# EAGLE design ISP_LPC900_USB_V3.3 (EAGLE 5.01)
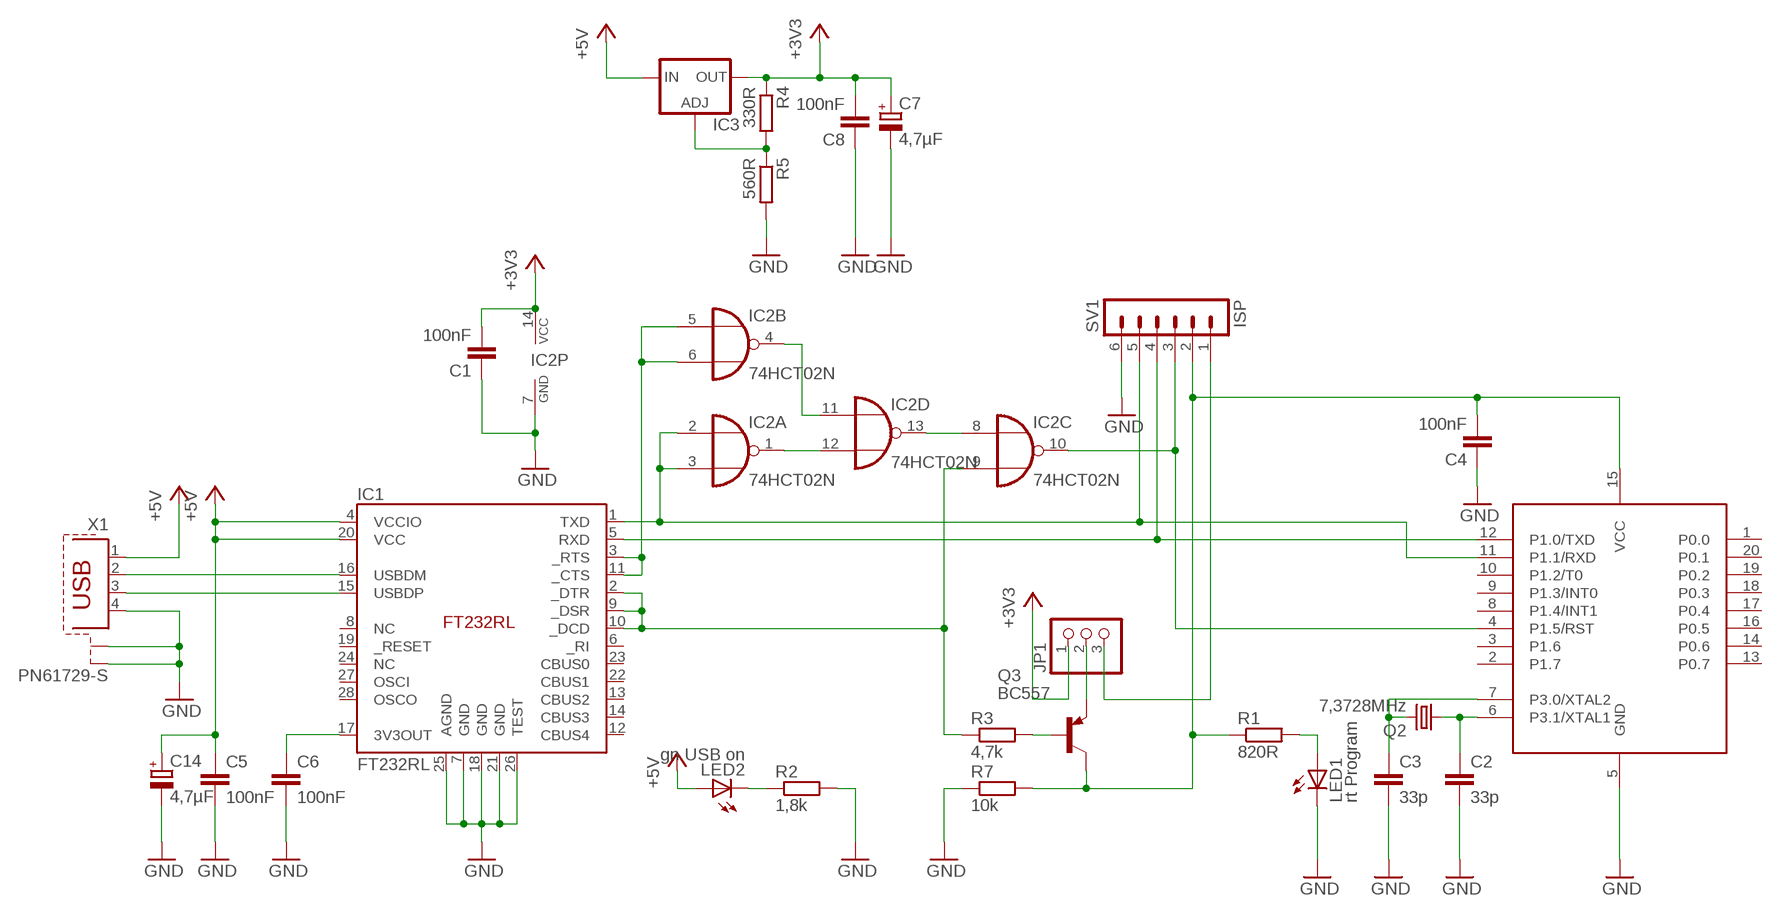
[diagram p0: schematic, sheet 1]

## Parts
C1  100nF  C-EU050-024X044  [C050-024X044]
C2  33p  C-EU025-024X044  [C025-024X044]
C3  33p  C-EU025-024X044  [C025-024X044]
C4  100nF  C-EU050-024X044  [C050-024X044]
C5  100nF  C-EU050-024X044  [C050-024X044]
C6  100nF  C-EU050-024X044  [C050-024X044]
C7  4,7µF  CPOL-EUE2.5-6  [E2,5-6]
C8  100nF  C-EU050-024X044  [C050-024X044]
C14  4,7µF  CPOL-EUE2.5-6  [E2,5-6]
IC1  FT232RL  [SSOP-28]
IC2  74HCT02N  [DIL14]
IC3  LM317L  [317L]
JP1  PINHD-1X3  [1X03]
LED1  rt Program  LED3MM  [LED3MM]
LED2  gn USB on  LED3MM  [LED3MM]
Q2  7,3728MHz  CRYSTALHC49S  [HC49/S]
Q3  BC557  [TO92]
R1  820R  R-EU_0207/7  [0207/7]
R2  1,8k  R-EU_0207/7  [0207/7]
R3  4,7k  R-EU_0204/7  [0204/7]
R4  330R  R-EU_0207/7  [0207/7]
R5  560R  R-EU_0207/7  [0207/7]
R7  10k  R-EU_0207/7  [0207/7]
SV1  ISP  MA06-1  [MA06-1]
U$1  P89LPC922  [DIL20]
X1  PN61729-S  [PN61729-S]

## Nets
+3V3: C1.2 C7.+ C8.2 IC2.14(P:VCC) IC3.2(OUT) JP1.1 R4.1
+5V: C5.1 C14.+ IC1.4(VCCIO) IC1.20(VCC) IC3.3(IN) LED2.A X1.1
DSR_DCD_DTR: IC1.2(_DTR) IC1.9(_DSR) IC1.10(_DCD) IC2.9(C:I1) R3.1
GND: C1.1 C2.2 C3.2 C4.1 C5.2 C6.2 C7.- C8.1 C14.- IC1.7(GND) IC1.18(GND) IC1.21(GND) IC1.25(AGND) IC1.26(TEST) IC2.7(P:GND) LED1.K(C) R2.2 R5.2 R7.1 SV1.6 U$1.5(GND) X1.4 X1.S1 X1.S2
N$1: IC1.5(RXD) SV1.4 U$1.12(P1.0/TXD)
N$2: C3.1 Q2.2 U$1.7(P3.0/XTAL2)
N$3: IC2.4(B:O) IC2.11(D:I0)
N$4: JP1.2 Q3.1(E)
N$5: IC2.10(C:O) SV1.3 U$1.4(P1.5/RST)
N$6: C4.2 Q3.3(C) R1.1 R7.2 SV1.2 U$1.15(VCC)
N$7: JP1.3 SV1.1
N$8: IC1.1(TXD) IC2.2(A:I0) IC2.3(A:I1) SV1.5 U$1.11(P1.1/RXD)
N$9: LED2.K(C) R2.1
N$10: IC2.1(A:O) IC2.12(D:I1)
N$11: C2.1 Q2.1 U$1.6(P3.1/XTAL1)
N$12: C6.1 IC1.17(3V3OUT)
N$13: LED1.A R1.2
N$14: IC1.16(USBDM) X1.2
N$15: IC2.8(C:I0) IC2.13(D:O)
N$16: IC3.1(ADJ) R4.2 R5.1
N$17: IC1.15(USBDP) X1.3
N$19: Q3.2(B) R3.2
RTS_CTS1: IC1.3(_RTS) IC1.11(_CTS) IC2.5(B:I0) IC2.6(B:I1)
Unconnected: IC1.6(_RI) IC1.8(NC) IC1.12(CBUS4) IC1.13(CBUS2) IC1.14(CBUS3) IC1.19(_RESET) IC1.22(CBUS1) IC1.23(CBUS0) IC1.24(NC) IC1.27(OSCI) IC1.28(OSCO) U$1.1(P0.0) U$1.2(P1.7) U$1.3(P1.6) U$1.8(P1.4/INT1) U$1.9(P1.3/INT0) U$1.10(P1.2/T0) U$1.13(P0.7) U$1.14(P0.6) U$1.16(P0.5) U$1.17(P0.4) U$1.18(P0.3) U$1.19(P0.2) U$1.20(P0.1)

## Library data of the parts
C1-C6 C8 = rcl:C-EU: CAPACITOR, European symbol
C7 C14 = rcl:CPOL-EU: POLARIZED CAPACITOR, European symbol
IC1 = ftdi4:FT232RL
IC2 = 74xx-eu:74*02: Quad 2-input NOR gate
IC3 = v-reg:LM317L: VOLTAGE REGULATOR
JP1 = pinhead:PINHD-1X3: PIN HEADER
LED1 LED2 = led:LED: LED OSRAM: - CHIPLED LG R971, LG N971, LY N971, LG Q971, LY Q971, LO R971, LY R971 LH N974, LH R974 LS Q976, LO Q976, LY Q976 LO Q996 - Hyper CHIPLED LW Q18S LB Q993, LB Q99A, LB R99A - SideLED LS A670, LO A670, LY A670, LG A670, LP A670 LB A673, LV A673, LT A673, LW A673 LH A674 LY A675 LS A676, LA A676, LO A676, LY A676, LW A676 LS A679, LY A679, LG A679 - Hyper Micro SIDELED® LS Y876, LA Y876, LO Y876, LY Y876 LT Y87S - SmartLED LW L88C, LW L88S LB L89C, LB L89S, LG L890 LS L89K, LO L89K, LY L89K LS L896, LA L896, LO L896, LY L896 - TOPLED LS T670, LO T670, LY T670, LG T670, LP T670 LSG T670, LSP T670, LSY T670, LOP T670, LYG T670 LG T671, LOG T671, LSG T671 LB T673, LV T673, LT T673, LW T673 LH T674 LS T676, LA T676, LO T676, LY T676, LB T676, LH T676, LSB T676, LW T676 LB T67C, LV T67C, LT T67C, LS T67K, LO T67K, LY T67K, LW E67C LS E67B, LA E67B, LO E67B, LY E67B, LB E67C, LV E67C, LT E67C LW T67C LS T679, LY T679, LG T679 LS T770, LO T770, LY T770, LG T770, LP T770 LB T773, LV T773, LT T773, LW T773 LH T774 LS E675, LA E675, LY E675, LS T675 LS T776, LA T776, LO T776, LY T776, LB T776 LHGB T686 LT T68C, LB T68C - Hyper Mini TOPLED® LB M676 - Mini TOPLED Santana® LG M470 LS M47K, LO M47K, LY M47K Source: http://www.osram.convergy.de - LUMILED® LXK2-PW12-R00, LXK2-PW12-S00, LXK2-PW14-U00, LXK2-PW14-V00 LXK2-PM12-R00, LXK2-PM12-S00, LXK2-PM14-U00 LXK2-PE12-Q00, LXK2-PE12-R00, LXK2-PE12-S00, LXK2-PE14-T00, LXK2-PE14-U00 LXK2-PB12-K00, LXK2-PB12-L00, LXK2-PB12-M00, LXK2-PB14-N00, LXK2-PB14-P00, LXK2-PB14-Q00 LXK2-PR12-L00, LXK2-PR12-M00, LXK2-PR14-Q00, LXK2-PR14-R00 LXK2-PD12-Q00, LXK2-PD12-R00, LXK2-PD12-S00 LXK2-PH12-R00, LXK2-PH12-S00 LXK2-PL12-P00, LXK2-PL12-Q00, LXK2-PL12-R00 Source: www.luxeon.com
Q2 = crystal:CRYSTAL: CRYSTAL
Q3 = transistor-pnp:BC557: PNP Transistor
R1-R5 R7 = rcl:R-EU_: RESISTOR, European symbol
SV1 = con-lstb:MA06-1: PIN HEADER
U$1 = micro-philips:P89LPC922
X1 = con-berg:PN61729-S: BERG USB connector

## Board
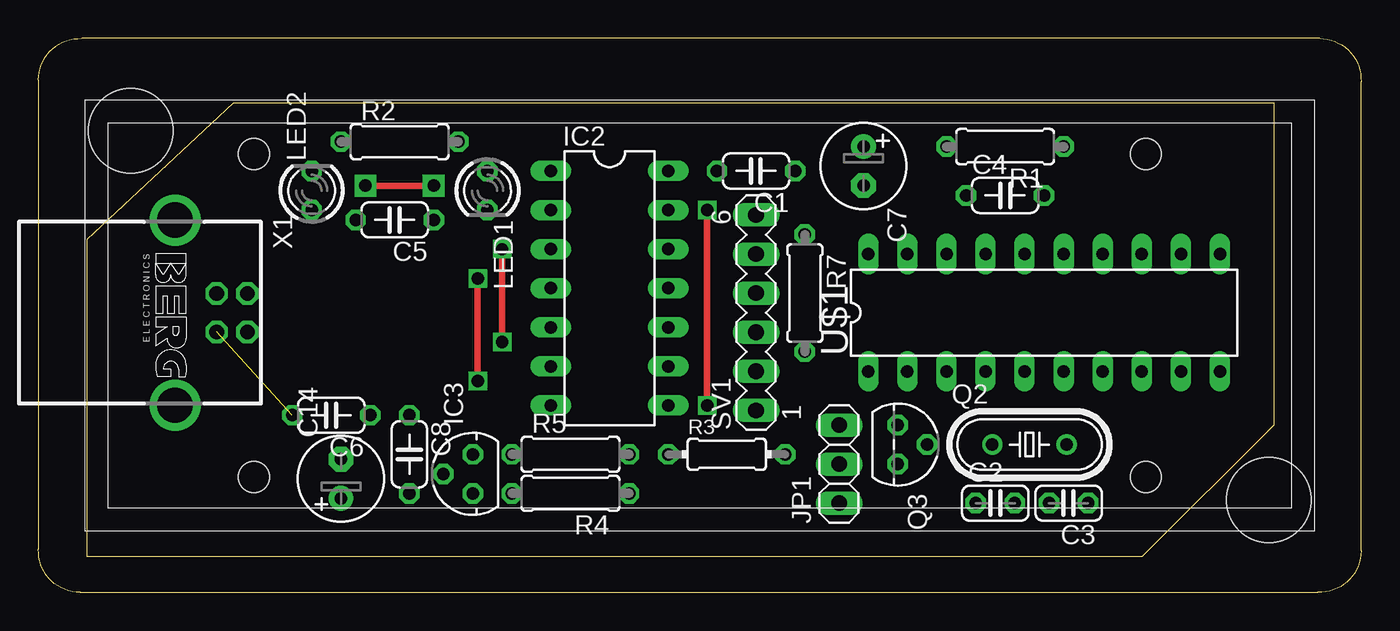
[diagram p1: board, top side]
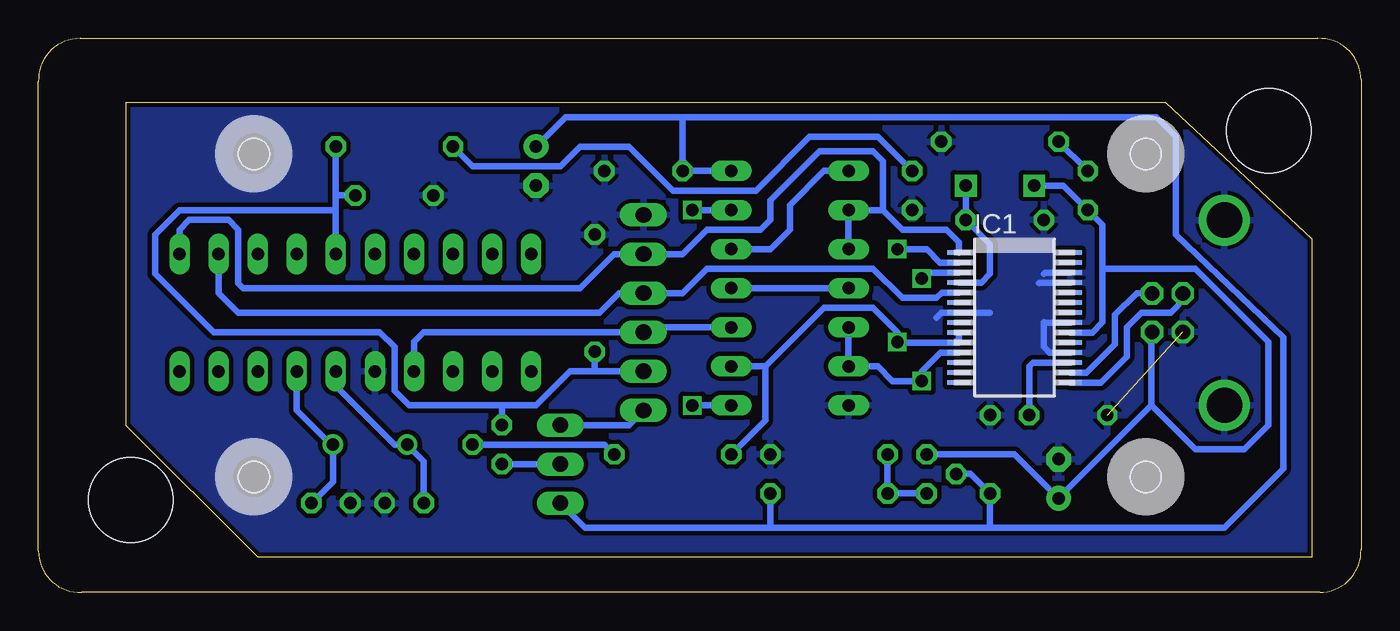
[diagram p2: board, bottom side, seen from below]

Size 86 x 36 mm. Coordinates in mm from the lower left corner, seen from the top.
Outline: 86,2.7 86,33.2 arc92 83.3,36 2.8,36 arc92 0,33.3 0,2.8 arc92 2.7,0 83.2,0 arc92 86,2.7
Outline: 80.31,10.88 71.74,2.3 3.16,2.3 3.16,22.94 12.69,31.83 80.31,31.83 80.31,10.88
Copper layers (1*16): Top 0.035mm / dielectric 1.5mm / Bottom 0.035mm
Design rules "default *": minimum track width 10mil, minimum drill 24mil, track to track 8mil, track to pad 8mil, pad to pad 8mil, via to via 8mil, smd to smd 8mil, copper to edge 10mil, drill to drill 10mil, minimum pad ring 10mil, minimum via ring 8mil, stop-mask expansion 4mil, vias tented up to drill 0mil, thermal gap 10mil
Holes 2 mm at 14,7.5 14,28.5 72,7.5 72,28.5
Holes 5.5 mm at 6,30 80,6

### Footprints (pad centres in the part's own frame; a part is rotated, then mirrored left to right if it is on the bottom)
C050-024X044 = drill 0.813 octagon: 1 -2.54,0; 2 2.54,0
C025-024X044 = drill 0.813 octagon: 1 -1.27,0; 2 1.27,0
E2,5-6 = drill 0.813 pad 1.6 round: + -1.27,0 | drill 0.813 pad 1.6 octagon: - 1.27,0
SSOP-28 = smd 0.3 x 1.5: 1 -4.225,-3.625; 2 -3.575,-3.625; 3 -2.925,-3.625; 4 -2.275,-3.625; 5 -1.625,-3.625; 6 -0.975,-3.625; 7 -0.325,-3.625; 8 0.325,-3.625; 9 0.975,-3.625; 10 1.625,-3.625; 11 2.275,-3.625; 12 2.925,-3.625; 13 3.575,-3.625; 14 4.225,-3.625; 15 4.225,3.625; 16 3.575,3.625; 17 2.925,3.625; 18 2.275,3.625; 19 1.625,3.625; 20 0.975,3.625; 21 0.325,3.625; 22 -0.325,3.625; 23 -0.975,3.625; 24 -1.625,3.625; 25 -2.275,3.625; 26 -2.925,3.625; 27 -3.575,3.625; 28 -4.225,3.625
DIL14 = drill 0.813 long: 1 -7.62,-3.81; 2 -5.08,-3.81; 3 -2.54,-3.81; 4 0,-3.81; 5 2.54,-3.81; 6 5.08,-3.81; 7 7.62,-3.81; 8 7.62,3.81; 9 5.08,3.81; 10 2.54,3.81; 11 0,3.81; 12 -2.54,3.81; 13 -5.08,3.81; 14 -7.62,3.81
317L = drill 0.813 octagon: 1 -1.27,0; 2 0,1.905; 3 1.27,0
1X03 = drill 1.016 long: 1 -2.54,0; 2 0,0; 3 2.54,0
LED3MM = drill 0.813 octagon: A -1.27,0; K 1.27,0
HC49/S = drill 0.813 round: 1 -2.413,0; 2 2.413,0
TO92 = drill 0.813 octagon: 1 1.27,0; 2 0,1.905; 3 -1.27,0
0207/7 = drill 0.813 octagon: 1 -3.81,0; 2 3.81,0
0204/7 = drill 0.813 octagon: 1 -3.81,0; 2 3.81,0
MA06-1 = drill 1.016 long: 1 -6.35,0; 2 -3.81,0; 3 -1.27,0; 4 1.27,0; 5 3.81,0; 6 6.35,0
DIL20 = drill 0.813 long: 1 -11.43,-3.81; 2 -8.89,-3.81; 3 -6.35,-3.81; 4 -3.81,-3.81; 5 -1.27,-3.81; 6 1.27,-3.81; 7 3.81,-3.81; 8 6.35,-3.81; 9 8.89,-3.81; 10 11.43,-3.81; 11 11.43,3.81; 12 8.89,3.81; 13 6.35,3.81; 14 3.81,3.81; 15 1.27,3.81; 16 -1.27,3.81; 17 -3.81,3.81; 18 -6.35,3.81; 19 -8.89,3.81; 20 -11.43,3.81
PN61729-S = drill 0.95 octagon: 1 1.25,4.71; 2 -1.25,4.71; 3 -1.25,2.71; 4 1.25,2.71 | drill 2.3 pad 2.9 round: S1 -6.02,0; S2 6.02,0

### Placement (x,y rotation side)
C1  46.66,27.39 180 top
C2  62.22,5.79 0 top
C3  66.98,5.79 180 top
C4  62.85,25.8 0 top
C5  23.16,24.21 180 top
C6  19.04,11.51 180 top
C7  53.64,27.7 270 top
C8  24.12,8.97 270 top
C14  19.67,7.38 90 top
IC1  22.53,17.86 270 bottom
IC2  37.13,19.77 270 top
IC3  28.24,7.7 90 top
JP1  52.06,8.34 90 top
LED1  29.2,26.12 270 top
LED2  17.77,26.12 90 top
Q2  64.44,9.61 0 top
Q3  55.87,9.61 270 top
R1  62.85,28.97 180 top
R2  23.48,29.29 0 top
R3  44.75,8.97 0 top
R4  34.59,6.43 180 top
R5  34.59,8.97 0 top
R7  49.84,19.45 270 top
SV1  46.66,18.18 90 top
U$1  65.39,18.18 0 top
X1  8.88,18.18 270 top

### Tracks (layer width: path | path; a pad name or v marks a point on that pad's centre or on a via)
+3V3
  Bottom 0.406: IC2.14 C1.2 44.12,30.88 | 44.12,30.88 13.32,30.88 12.05,29.61 12.05,23.26 5.07,16.59 5.07,8.02 8.88,4.21 24.12,4.21 | 24.12,4.21 38.4,4.21 | 38.4,4.21 50.47,4.21 JP1.1 | 44.12,30.88 51.74,30.88 C7.+ | IC3.2 25.39,7.7 C8.2 24.12,4.21 | 38.4,4.21 R4.1
+5V  (via drill 0.8 pad 1.42)
  Top 0.406: v21.26,26.43 v25.7,26.43
  Bottom 0.406: 18.74,16.89 IC1.20 17.47,16.89 16.81,17.54 16.81,21.04 | IC1.4 24.7,20.14 24.12,20.72 24.12,22.62 C5.1 v25.7,26.43 | 16.81,21.04 16.81,23.89 LED2.A 19.35,26.43 v21.26,26.43 | 13.64,12.14 C14.+ 22.53,8.97 IC3.3 | X1.1 13.62,16.93 13.64,16.91 13.64,12.14 | 16.81,21.04 10.78,21.04 6.02,16.27 6.02,10.88 7.61,9.29 10.78,9.29 13.64,12.14
DSR_DCD_DTR  (via drill 0.8)
  Top 0.406: v30.15,16.27 v30.15,22.3
  Bottom 0.406: 38.72,14.69 34.91,18.5 31.74,18.5 30.15,16.91 v30.15,16.27 30.11,16.23 IC1.10 26.3,16.23 26.34,16.27 26.16,16.46 IC1.9 | 38.72,14.69 IC2.9 | IC1.2 27.38,21.44 28.24,22.3 v30.15,22.3 | 38.72,14.69 38.72,11.19 R3.1
GND  (1 unrouted)
  Bottom 0.406: IC1.21 20.62,17.54 20.62,15.96 | 20.62,15.96 20.31,15.64 | IC1.18 20.26,15.58 20.62,15.96 | 24.12,18.18 24.12,18.19 IC1.7 27.29,18.19 27.61,17.86 | IC1.26 20.56,20.79 20.62,20.72 | IC1.25 20.89,20.14 20.94,20.08
  pour Bottom (isolate 0.3): 3.16,22.94 12.69,31.83 80.31,31.83 80.31,10.88 71.74,2.3 3.16,2.3
N$1
  Bottom 0.406: IC1.5 27.26,19.49 27.61,19.13 29.83,19.13 31.74,21.04 42.53,21.04 44.12,19.45 SV1.4 48.25,19.45 49.52,18.18 73.01,18.18 74.28,19.45 U$1.12
N$2
  Bottom 0.406: U$1.7 69.2,11.83 66.98,9.61 Q2.2 66.85,7.19 C3.1
N$3
  Bottom 0.406: IC2.4 IC2.11
N$4
  Bottom 0.406: JP1.2 Q3.1
N$5
  Bottom 0.406: IC2.10 46.34,17.23 SV1.3 60.95,16.91 61.58,16.27 U$1.4
N$6
  Bottom 0.406: SV1.2 49.84,14.37 | 49.84,14.37 R7.2 | 55.87,12.14 53.64,12.14 51.42,14.37 49.84,14.37 | 55.87,12.14 61.9,12.14 62.85,13.1 62.85,15.96 63.81,16.91 74.6,16.91 78.41,20.72 78.41,23.26 76.82,24.85 66.66,24.85 | 55.87,12.14 Q3.3 | 66.66,24.85 66.66,25.8 | 66.66,24.85 U$1.15 | 66.66,25.8 R1.1 | 66.66,25.8 C4.2
N$7
  Bottom 0.406: JP1.3 47.61,10.88 SV1.1
N$8
  Bottom 0.406: IC2.3 IC2.2 31.1,24.85 | 31.1,24.85 29.83,23.58 26.97,23.58 26.16,22.76 IC1.1 | 31.1,24.85 31.1,28.02 31.74,28.66 35.23,28.66 38.4,25.48 38.4,24.21 39.04,23.58 42.53,23.58 44.12,21.99 SV1.5 48.56,21.99 50.79,19.77 72.7,19.77 73.01,20.08 73.01,23.58 73.65,24.21 76.19,24.21 76.82,23.58 U$1.11
N$9
  Bottom 0.406: LED2.K R2.1
N$10
  Bottom 0.406: IC2.12 38.4,22.3 37.13,23.58 37.13,25.16 34.91,27.39 IC2.1
N$11
  Bottom 0.406: U$1.6 66.66,13.41 62.85,9.61 Q2.1 60.95,8.53 C2.1
N$12
  Bottom 0.406: IC1.17 21.33,14.94 21.58,14.69 C6.1
N$13
  Bottom 0.406: LED1.A 31.42,29.61 35.86,29.61 39.36,26.12 44.75,26.12 47.61,28.97 50.79,28.97 52.06,27.7 57.77,27.7 R1.2
N$14
  Bottom 0.406: IC1.16 17.85,14.29 16.18,15.96 16.17,15.96 16.01,16.11 16.01,18.03 14.59,19.45 13.64,19.45 13.62,19.43 X1.2
N$15  (via drill 0.8)
  Top 0.406: v43.49,12.14 v43.49,24.85
  Bottom 0.406: v43.49,24.85 IC2.13 | IC2.8 v43.49,12.14
N$16
  Bottom 0.406: IC3.1 R4.2 R5.1
N$17
  Bottom 0.406: IC1.15 16.91,13.63 15.23,15.32 15.23,17.23 14.28,18.18 12.37,18.18 11.42,19.13 11.59,19.3 X1.3
N$19
  Bottom 0.406: Q3.2 49.2,9.61 R3.2
RTS_CTS1  (via drill 0.8)
  Top 0.406: v28.56,13.73 v28.56,20.4
  Bottom 0.406: IC2.5 IC2.6 31.42,14.69 30.47,13.73 v28.56,13.73 28.56,14.37 27.34,15.58 IC1.11 | IC1.3 28.81,20.79 v28.56,20.4